# Altium schematic sheet Sheet1.SchDoc: Специализированный модуль LoRa
size 420 x 297 mm; ApprovedBy: Алексеев; CheckedBy: Богданов; Author: Шумкин; DrawnBy: Человек; DocumentNumber: АЕСН.464431.002Э3; SheetNumber: 1; SheetTotal: 2; PERVICH PRIM: АЕСН.464431.002; Title2: Схема электрическая принципиальная; DocumentName: Sheet1.SCHDOC; Application_BuildNumber: sdfsdfsdfsdfsdfs
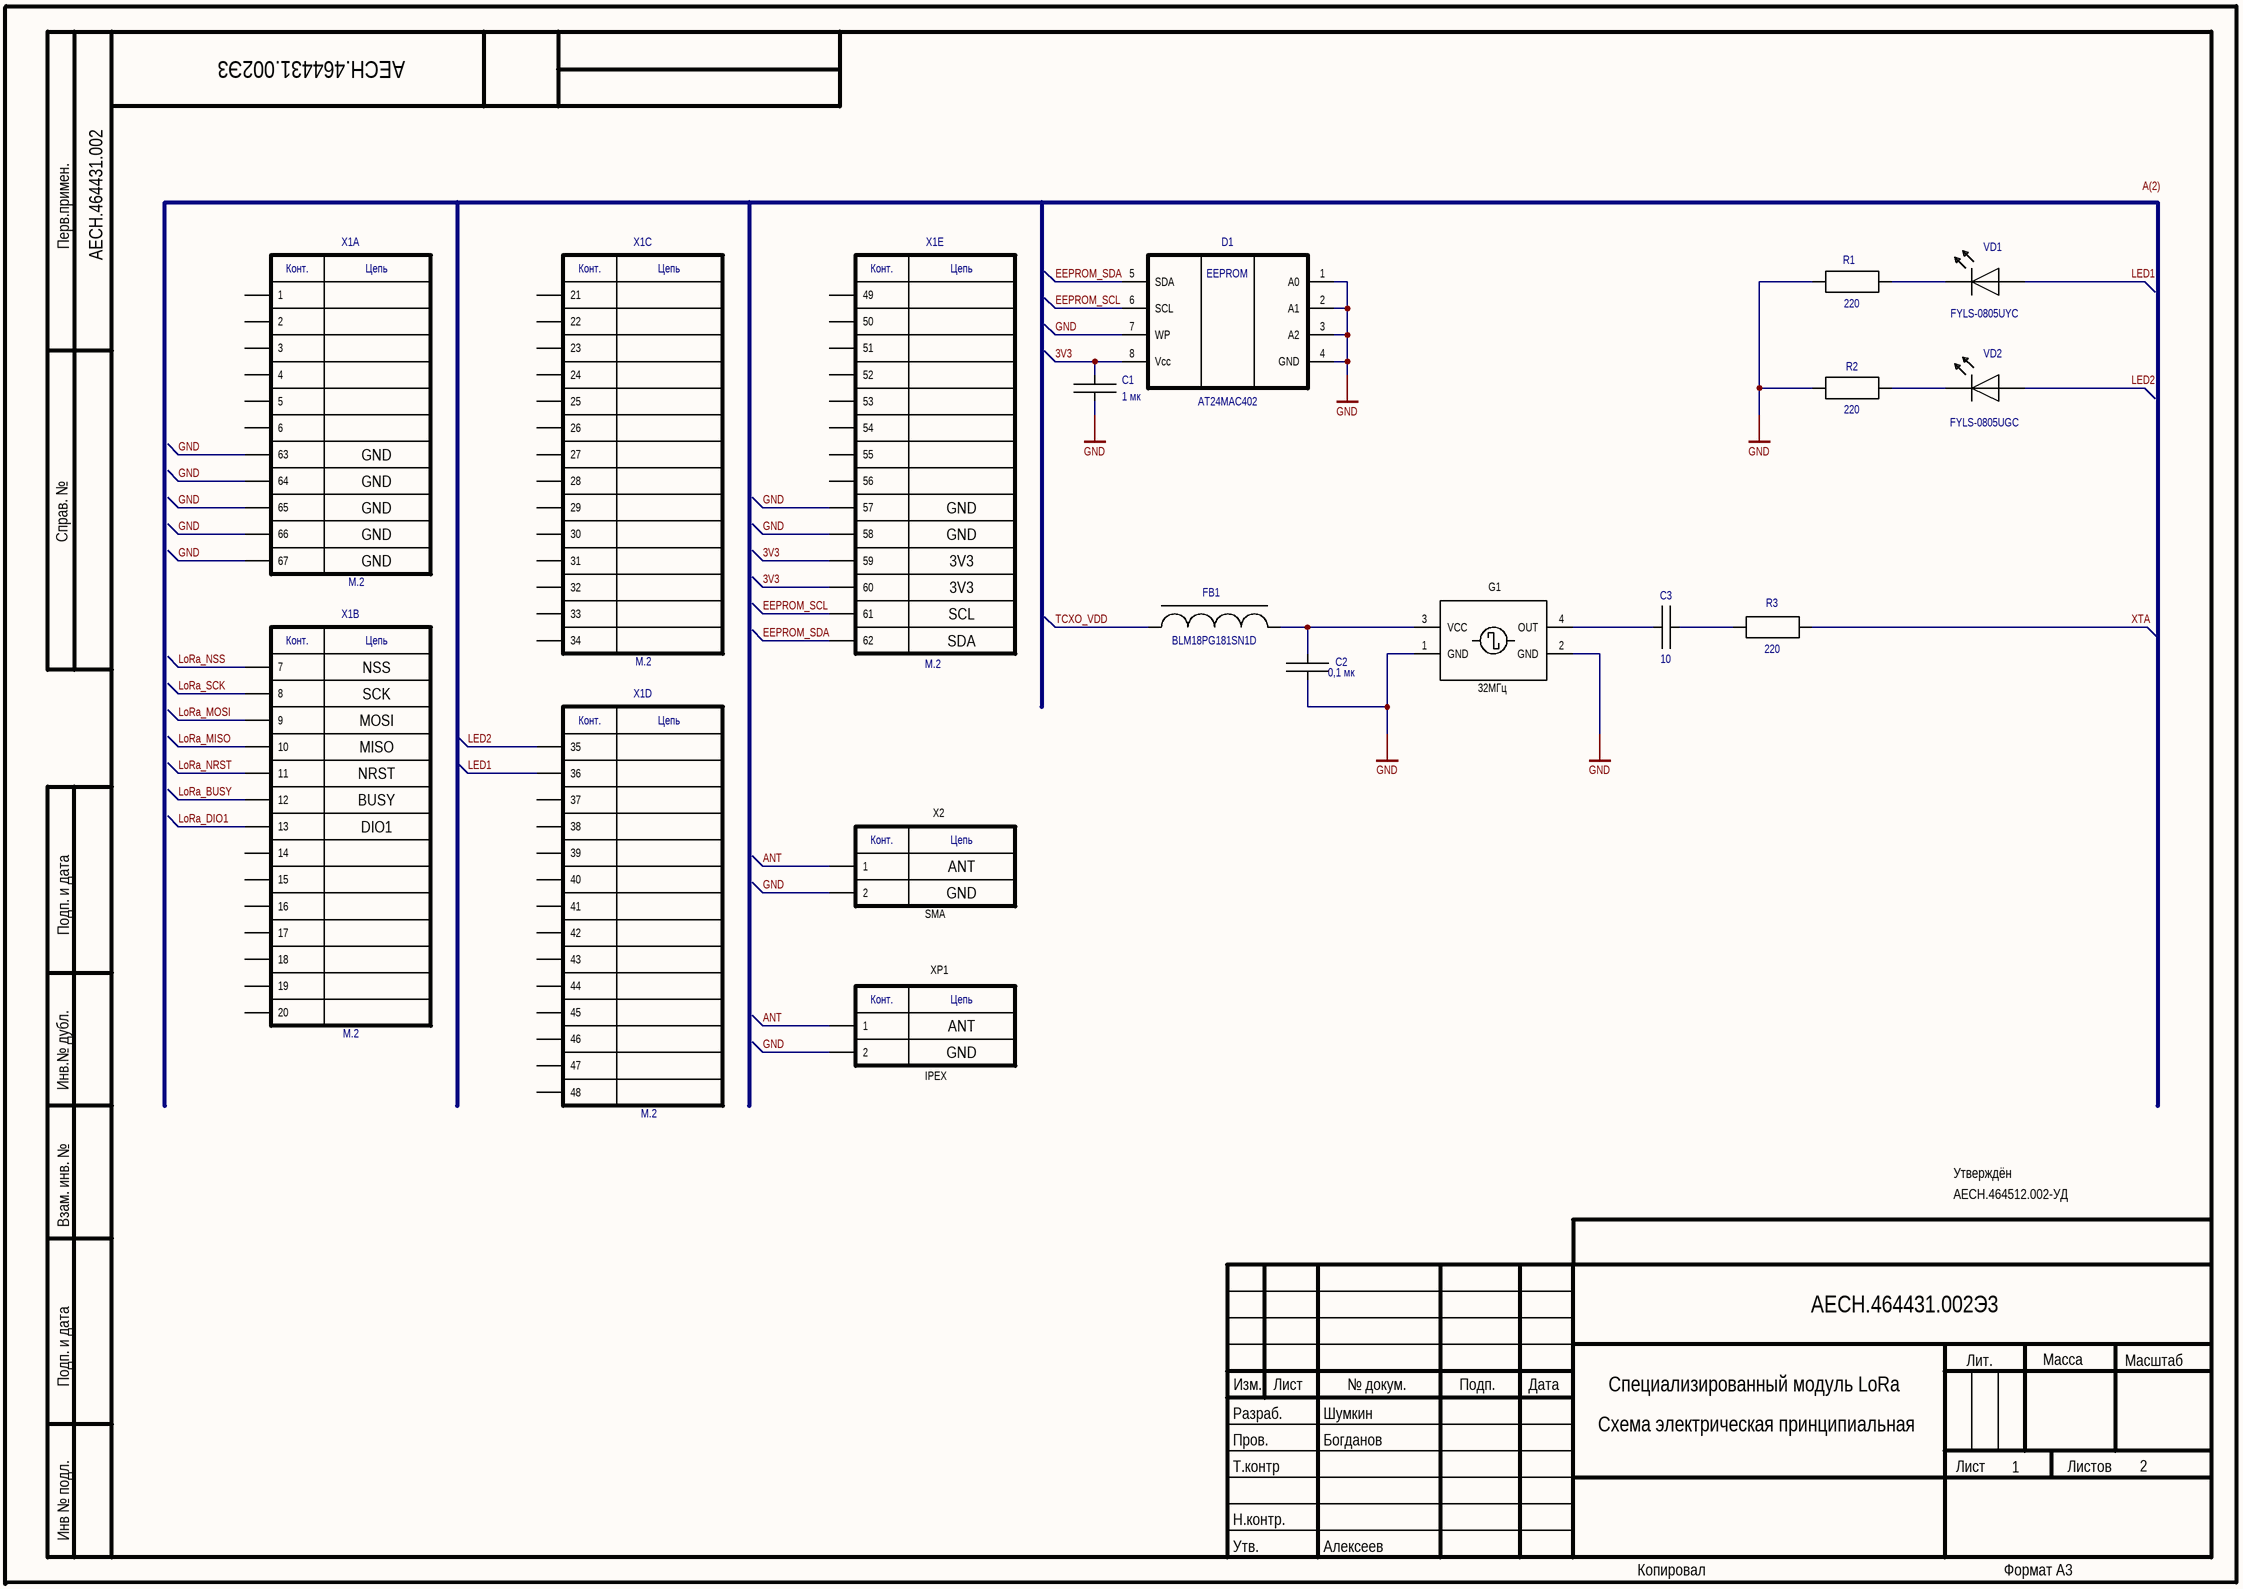
[diagram p0: Sheet1.SchDoc]

## Parts
C1  value 1 мк  [С0603]  (hidden comment: C)
C2  value 0,1 мк  [С0603]  (hidden comment: C)
C3  value 10  [С0603]  (hidden comment: C)
D1  AT24MAC402  [SOIC8]
FB1  value BLM18PG181SN1D  [R0603]  (hidden comment: Ferrite_Beads)
G1  32МГц  [OSC_2016]
R1  value 220  [R0603]  (hidden comment: R)
R2  value 220  [R0603]  (hidden comment: R)
R3  value 220  [R0603]  (hidden comment: R)
VD1  FYLS-0805UYC  [LED_0805]
VD2  FYLS-0805UGC  [LED_0805]
X1  M.2  [M.2_edge]  (parts A,B,C,D,E of 5)
X2  SMA  [SMA_kont]
XP1  IPEX  [IPEX]

## Nets
GND: C1.2 C2.2 D1.1(A0) D1.2(A1) D1.3(A2) D1.4(GND) D1.7(WP) G1.1(GND) G1.2(GND) R1.2 R2.2 X1.57 X1.58 X1.63 X1.64 X1.65 X1.66 X1.67 X2.2 XP1.2
3V3: C1.1 D1.8(Vcc) X1.59 X1.60
ANT: X2.1 XP1.1
EEPROM_SCL: D1.6(SCL) X1.61
EEPROM_SDA: D1.5(SDA) X1.62
LED1: VD1.1 X1.36
LED2: VD2.1 X1.35
LoRa_BUSY: X1.12
LoRa_DIO1: X1.13
LoRa_MISO: X1.10
LoRa_MOSI: X1.9
LoRa_NRST: X1.11
LoRa_NSS: X1.7
LoRa_SCK: X1.8
TCXO_VDD: FB1.1
XTA: R3.2
NetC2_1: C2.1 FB1.2 G1.3(VCC)
NetC3_1: C3.1 G1.4(OUT)
NetC3_2: C3.2 R3.1
NetR1_1: R1.1 VD1.2
NetR2_1: R2.1 VD2.2

Not connected (* = marked no-connect by the designer): X1 1 2 3 4 5 6 14 15 16 17 18 19 20 21 22 23 24 25 26 27 28 29 30 31 32 33 34 37 38 39 40 41 42 43 44 45 46 47 48 49 50 51 52 53 54 55 56

## Notes on the sheet
- GND
- 3V3
- NSS
- SCL
- SDA
- SCK
- MOSI
- MISO
- NRST
- BUSY
- DIO1
- ANT
- АЕСН.464512.002-УД
- Утверждён
- Labels drawn without touching a wire or pin: A(2)
- Перв.примен.
- Справ. №
- Подп. и дата
- Инв.№ дубл.
- Взам. инв. №
- Изм.
- Лист
- № докум.
- Подп.
- Дата
- Лит.
- Масса
- Масштаб
- Пров.
- Т.контр
- Разраб.
- Листов
- Инв № подл.
- Н.контр.
- Утв.
- Копировал
- Формат А3
- (in symbol 2pin) Конт.; Цепь
- (in symbol AT24MAC402) EEPROM
- (in symbol M.2, part A) Конт.; Цепь
- (in symbol M.2, part B) Конт.; Цепь
- (in symbol M.2, part C) Конт.; Цепь
- (in symbol M.2, part D) Конт.; Цепь
- (in symbol M.2, part E) Конт.; Цепь

## Library data of the parts
C1 C2 = C: Voltage: 16 В
C3 = C: Voltage: 50 В
G1 = TCXO: Value: NT2016SA 32MHz END4263A
VD1 VD2 = VD_LED: Voltage: ?
X2 XP1 = 2pin